# Altium project systems_wiring_diagram.PrjPCB
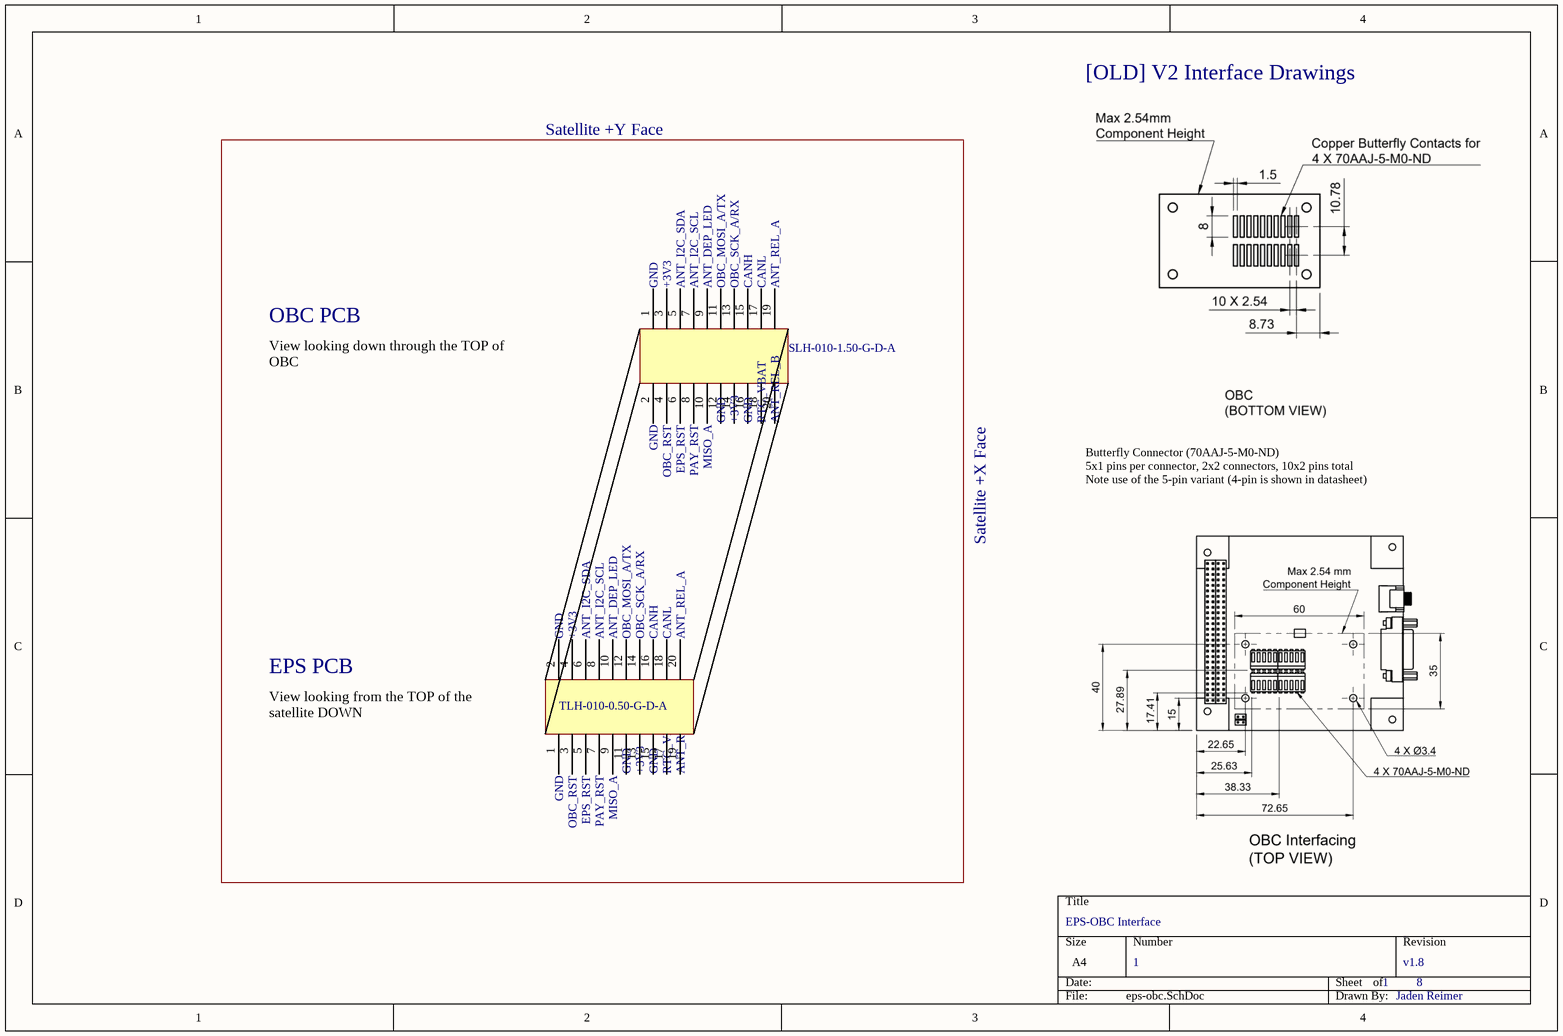
[diagram p0: eps-obc.SchDoc]
ProjectSheetTotal: 8; ProjectRevision: v1.8; ProjectDrawnBy: Jaden Reimer
8 sheets, 83 parts. Net scope: global (net labels, ports and power ports of the same name join across sheets).
Sheets:
  eps-obc.SchDoc
  eps-pay.SchDoc
  eps-sys.SchDoc
  com.SchDoc
  can.SchDoc
  bus.SchDoc
  pay.SchDoc
  sys.SchDoc

## Sheet eps-obc.SchDoc: EPS-OBC Interface
size A4; DocumentNumber: 1; SheetNumber: 1; SheetTotal: 8

### Parts
(Parts that share a designator on the sheet are numbered #1, #2 ... from top to bottom, then left to right.)
J?#1  SLH-010-1.50-G-D-A  [SLH-010-1.50-G-D-A]
J?#2  TLH-010-0.50-G-D-A  [TLH-010-0.50-G-D-A]

### Nets

Not connected (* = marked no-connect by the designer): J?#1 1 2 3 4 5 6 7 8 9 10 11 12 13 14 15 16 17 18 19 20; J?#2 1 2 3 4 5 6 7 8 9 10 11 12 13 14 15 16 17 18 19 20

### Notes on the sheet
- [OLD] V2 Interface Drawings
- Satellite +Y Face
- (near J?#1) GND
- (near J?#1) +3V3
- (near J?#1) ANT_I2C_SDA
- (near J?#1) ANT_I2C_SCL
- (near J?#1) ANT_DEP_LED
- (near J?#1) OBC_MOSI_A/TX
- (near J?#1) OBC_SCK_A/RX
- (near J?#1) CANH
- (near J?#1) CANL
- (near J?#1) ANT_REL_A
- View looking down through the TOP of OBC
- OBC PCB
- (near J?#1) OBC_RST
- (near J?#1) EPS_RST
- (near J?#1) PAY_RST
- (near J?#1) MISO_A
- (near J?#1) RTC_VBAT
- (near J?#1) ANT_REL_B
- Butterfly Connector (70AAJ-5-M0-ND)
  5x1 pins per connector, 2x2 connectors, 10x2 pins total
  Note use of the 5-pin variant (4-pin is shown in datasheet)
- Satellite +X Face
- (near J?#2) GND
- (near J?#2) +3V3
- (near J?#2) ANT_I2C_SDA
- (near J?#2) ANT_I2C_SCL
- (near J?#2) ANT_DEP_LED
- (near J?#2) OBC_MOSI_A/TX
- (near J?#2) OBC_SCK_A/RX
- (near J?#2) CANH
- (near J?#2) CANL
- (near J?#2) ANT_REL_A
- EPS PCB
- (near J?#2) View looking from the TOP of the satellite DOWN
- (near J?#2) OBC_RST
- (near J?#2) EPS_RST
- (near J?#2) PAY_RST
- (near J?#2) MISO_A
- (near J?#2) RTC_VBAT
- (near J?#2) ANT_REL_B

### Library data of the parts
J?#1 = SLH-010-1.50-G-D-A: 0.50 mm Razor Beam™ LP Ultra Low Profile Socket Strip, alignment pin option; Supplier 1: SLH-010-1.50-G-D-A; Supplier Part Number 1: Samtec; ComponentLink1Description: Product Page; ComponentLink1URL: https://www.samtec.com/products/slh-010-1.50-g-d-a
J?#2 = TLH-010-0.50-G-D-A: 0.50 mm Razor Beam LP Ultra Low Profile Terminal Strip, alignment pin option; Supplier 1: Samtec; ComponentLink1Description: Product Page; ComponentLink1URL: https://www.samtec.com/products/tlh-010-0.50-g-d-a; Supplier Part Number 1: TLH-010-0.50-G-D-A

## Sheet eps-pay.SchDoc: EPS-PAY Interface
size A4; DocumentNumber: 2; SheetNumber: 2; SheetTotal: 8
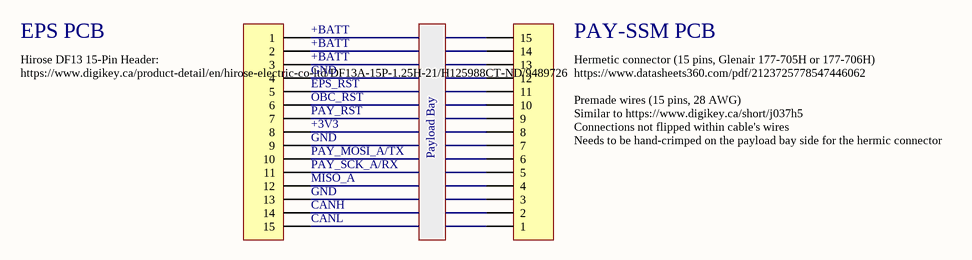
[diagram p1: eps-pay.SchDoc]

### Parts
(Parts that share a designator on the sheet are numbered #1, #2 ... from top to bottom, then left to right.)
P?#1  Header 15  [HDR1X15]  (value not drawn)
P?#2  Header 15  [HDR1X15]  (value not drawn)

### Nets

Not connected (* = marked no-connect by the designer): P?#1 1 2 3 4 5 6 7 8 9 10 11 12 13 14 15; P?#2 1 2 3 4 5 6 7 8 9 10 11 12 13 14 15

### Notes on the sheet
- EPS PCB
- (near P?#1) +BATT
- (near P?#1) GND
- PAY-SSM PCB
- Hermetic connector (15 pins, Glenair 177-705H or 177-706H)
  https://www.datasheets360.com/pdf/2123725778547446062
- Hirose DF13 15-Pin Header:
  https://www.digikey.ca/product-detail/en/hirose-electric-co-ltd/DF13A-15P-1.25H-21/H125988CT-ND/9489726
- (near P?#1) +3V3
- (near P?#1) OBC_RST
- (near P?#1) EPS_RST
- (near P?#1) PAY_RST
- Premade wires (15 pins, 28 AWG)
  Similar to https://www.digikey.ca/short/j037h5
  Connections not flipped within cable's wires
  Needs to be hand-crimped on the payload bay side for the hermic connector
- (near P?#1) CANH
- (near P?#1) PAY_MOSI_A/TX
- (near P?#1) MISO_A
- (near P?#1) PAY_SCK_A/RX
- Payload Bay
- (near P?#1) CANL

### Library data of the parts
P?#1 P?#2 = Header 15: Header, 15-Pin; LatestRevisionDate: 17-Jul-2002; LatestRevisionNote: Re-released for DXP Platform.; Publisher: Altium Limited

## Sheet eps-sys.SchDoc: EPS-SYS Interface
size A4; DocumentNumber: 3; SheetNumber: 3; SheetTotal: 8
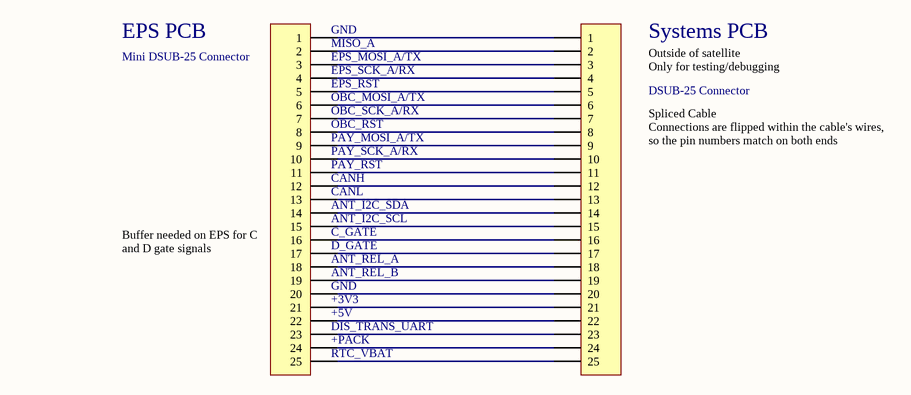
[diagram p2: eps-sys.SchDoc]

### Parts
(Parts that share a designator on the sheet are numbered #1, #2 ... from top to bottom, then left to right.)
P?#3  Header 25  [HDR1X25]  (value not drawn)
P?#4  Header 25  [HDR1X25]  (value not drawn)

### Nets
NetP?#3_1: P?#3.1 P?#4.1
NetP?#3_2: P?#3.2 P?#4.2
NetP?#3_3: P?#3.3 P?#4.3
NetP?#3_4: P?#3.4 P?#4.4
NetP?#3_5: P?#3.5 P?#4.5
NetP?#3_6: P?#3.6 P?#4.6
NetP?#3_7: P?#3.7 P?#4.7
NetP?#3_8: P?#3.8 P?#4.8
NetP?#3_9: P?#3.9 P?#4.9
NetP?#3_10: P?#3.10 P?#4.10
NetP?#3_11: P?#3.11 P?#4.11
NetP?#3_12: P?#3.12 P?#4.12
NetP?#3_13: P?#3.13 P?#4.13
NetP?#3_14: P?#3.14 P?#4.14
NetP?#3_15: P?#3.15 P?#4.15
NetP?#3_16: P?#3.16 P?#4.16
NetP?#3_17: P?#3.17 P?#4.17
NetP?#3_18: P?#3.18 P?#4.18
NetP?#3_19: P?#3.19 P?#4.19
NetP?#3_20: P?#3.20 P?#4.20
NetP?#3_21: P?#3.21 P?#4.21
NetP?#3_22: P?#3.22 P?#4.22
NetP?#3_23: P?#3.23 P?#4.23
NetP?#3_24: P?#3.24 P?#4.24
NetP?#3_25: P?#3.25 P?#4.25

### Notes on the sheet
- EPS PCB
- Mini DSUB-25 Connector
- (near P?#3) GND
- (near P?#3) MISO_A
- (near P?#3) EPS_MOSI_A/TX
- (near P?#3) EPS_SCK_A/RX
- Systems PCB
- Outside of satellite
  Only for testing/debugging
- (near P?#3) EPS_RST
- (near P?#3) OBC_MOSI_A/TX
- (near P?#3) OBC_SCK_A/RX
- (near P?#3) OBC_RST
- DSUB-25 Connector
- (near P?#3) PAY_MOSI_A/TX
- (near P?#3) PAY_SCK_A/RX
- (near P?#3) PAY_RST
- (near P?#3) CANH
- (near P?#3) CANL
- (near P?#3) ANT_I2C_SDA
- Spliced Cable
  Connections are flipped within the cable's wires,
  so the pin numbers match on both ends
- (near P?#3) Buffer needed on EPS for C and D gate signals
- (near P?#3) ANT_REL_A
- (near P?#3) D_GATE
- (near P?#3) C_GATE
- (near P?#3) ANT_I2C_SCL
- (near P?#3) +5V
- (near P?#3) ANT_REL_B
- (near P?#3) +3V3
- (near P?#3) +PACK
- (near P?#3) DIS_TRANS_UART
- (near P?#3) RTC_VBAT

### Library data of the parts
P?#3 P?#4 = Header 25: Header, 25-Pin; LatestRevisionDate: 17-Jul-2002; LatestRevisionNote: Re-released for DXP Platform.; Publisher: Altium Limited

## Sheet com.SchDoc: Communications
size A4; DocumentNumber: 4; SheetNumber: 4; SheetTotal: 8
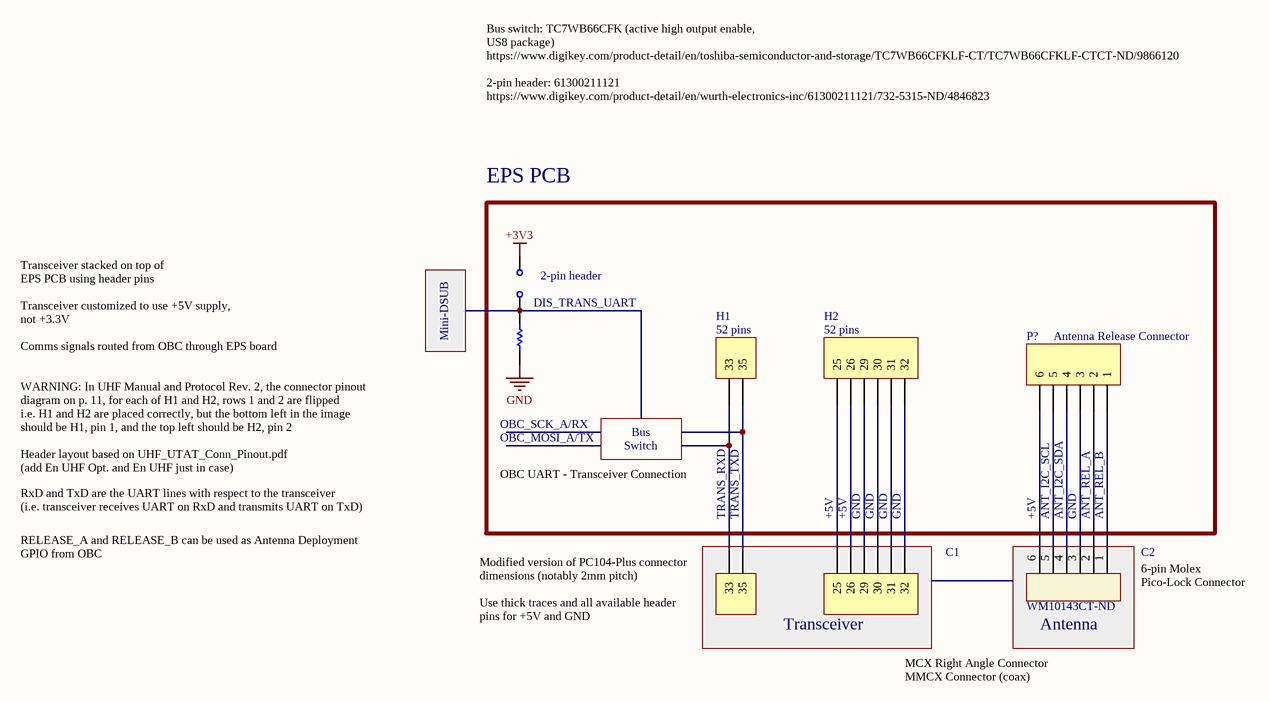
[diagram p3: com.SchDoc]

### Parts
(Parts that share a designator on the sheet are numbered #1, #2 ... from top to bottom, then left to right.)
J?#3  Supplier Part Number 1: WM10143CT-ND  [MOLEX_504050-0691]  (hidden comment: 504050-0691)
P?#5  Header 2  [HDR1X2]  (value not drawn)
P?#6  Header 6  [HDR1X6]  (value not drawn)
P?#7  Header 6  [HDR1X6]  (value not drawn)
P?#8  Header 2  [HDR1X2]  (value not drawn)
P?#9  Header 6  [HDR1X6]  (value not drawn)
R?#1  0402  [RES0402R]  (value not drawn)

### Blocks framed on the sheet
EPS PCB: P?#5-P?#7 R?#1
Transceiver: P?#8 P?#9
Antenna: J?#3

### Nets
GND: R?#1.1
NetJ?#3_1: J?#3.1 P?#7.1
NetJ?#3_2: J?#3.2 P?#7.2
NetJ?#3_3: J?#3.3 P?#7.3
NetJ?#3_4: J?#3.4 P?#7.4
NetJ?#3_5: J?#3.5 P?#7.5
NetJ?#3_6: J?#3.6 P?#7.6
NetP?#5_1: P?#5.1(33) P?#8.1(33)
NetP?#5_2: P?#5.2(35) P?#8.2(35)
NetP?#6_1: P?#6.1(25) P?#9.1(25)
NetP?#6_2: P?#6.2(26) P?#9.2(26)
NetP?#6_3: P?#6.3(29) P?#9.3(29)
NetP?#6_4: P?#6.4(30) P?#9.4(30)
NetP?#6_5: P?#6.5(31) P?#9.5(31)
NetP?#6_6: P?#6.6(32) P?#9.6(32)

Not connected (* = marked no-connect by the designer): R?#1 2

### Notes on the sheet
- Bus switch: TC7WB66CFK (active high output enable, US8 package)
  https://www.digikey.com/product-detail/en/toshiba-semiconductor-and-storage/TC7WB66CFKLF-CT/TC7WB66CFKLF-CTCT-ND/9866120
  2-pin header: 61300211121
  https://www.digikey.com/product-detail/en/wurth-electronics-inc/61300211121/732-5315-ND/4846823
- Transceiver stacked on top of EPS PCB using header pins
- (near R?#1) 2-pin header
- Comms signals routed from OBC through EPS board
- Transceiver customized to use +5V supply, not +3.3V
  To get 2W of power
  (add En UHF Opt. and En UHF just in case)
- Mini-DSUB
- (near R?#1) DIS_TRANS_UART
- (near P?#5) 52 pins
- H1
- (near P?#6) 52 pins
- H2
- (near P?#7) Antenna Release Connector
- WARNING: In UHF Manual and Protocol Rev. 2, the connector pinout diagram on p. 11, for each of H1 and H2, rows 1 and 2 are flipped
  i.e. H1 and H2 are placed correctly, but the bottom left in the image should be H1, pin 1, and the top left should be H2, pin 2
- OBC_SCK_A/RX
- Bus
- Header layout based on UHF_UTAT_Conn_Pinout.pdf
  (add En UHF Opt. and En UHF just in case)
- OBC UART - Transceiver Connection
- OBC_MOSI_A/TX
- Switch
- RxD and TxD are the UART lines with respect to the transceiver
  (i.e. transceiver receives UART on RxD and transmits UART on TxD)
- RELEASE_A and RELEASE_B can be used as Antenna Deployment GPIO from OBC
- TRANS_RXD
- TRANS_TXD
- +5V
- GND
- (near P?#9) C1
- ANT_I2C_SCL
- ANT_I2C_SDA
- ANT_REL_A
- ANT_REL_B
- (near J?#3) C2
- (near P?#8) Modified version of PC104-Plus connector dimensions (notably 2mm pitch)
- (near P?#8) Use thick traces and all available header pins for +5V and GND
- (near J?#3) 6-pin Molex Pico-Lock Connector
- MCX Right Angle Connector
  MMCX Connector (coax)
- Labels drawn without touching a wire or pin: +3V3

### Library data of the parts
J?#3 = 504050-0691: Wire-To-Board Connector, Pico-Lock 504050 Series, Surface Mount, Header, 6, 1.5 mm; Supplier 1: Digi-Key
P?#5 P?#8 = Header 2: Header, 2-Pin; LatestRevisionDate: 17-Jul-2002; LatestRevisionNote: Re-released for DXP Platform.; Publisher: Altium Limited
P?#6 P?#7 P?#9 = Header 6: Header, 6-Pin; LatestRevisionDate: 17-Jul-2002; LatestRevisionNote: Re-released for DXP Platform.; Publisher: Altium Limited
R?#1 = RES0402: 0402 resistor; Value: Value

## Sheet can.SchDoc: CAN Bus
size A4; DocumentNumber: 5; SheetNumber: 5; SheetTotal: 8
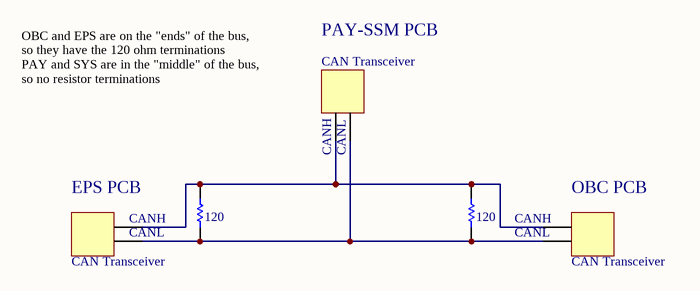
[diagram p4: can.SchDoc]

### Parts
(Parts that share a designator on the sheet are numbered #1, #2 ... from top to bottom, then left to right.)
P?#10  CAN Transceiver  [HDR1X2]
P?#11  CAN Transceiver  [HDR1X2]
P?#12  CAN Transceiver  [HDR1X2]
R?#2  value 120  [AXIAL-0.3]  (hidden comment: Res1)
R?#3  value 120  [AXIAL-0.3]  (hidden comment: Res1)

### Nets
NetP?#10_1: P?#10.1 P?#11.1 P?#12.2 R?#2.1 R?#3.2
NetP?#10_2: P?#10.2 P?#11.2 P?#12.1 R?#2.2 R?#3.1

### Notes on the sheet
- PAY-SSM PCB
- OBC and EPS are on the "ends" of the bus, so they have the 120 ohm terminations
  PAY and SYS are in the "middle" of the bus, so no resistor terminations
- (near P?#12) EPS PCB
- (near P?#10) CANH
- (near P?#10) CANL
- (near P?#11) OBC PCB
- (near P?#12) CANH
- (near P?#12) CANL
- CANH
- CANL

### Library data of the parts
P?#10-P?#12 = Header 2: Header, 2-Pin; LatestRevisionDate: 17-Jul-2002; LatestRevisionNote: Re-released for DXP Platform.; Publisher: Altium Limited
R?#2 R?#3 = Res1: Resistor; Published: 8-Jun-2000; LatestRevisionDate: 17-Jul-2002; LatestRevisionNote: Re-released for DXP Platform.; PackageReference: AXIAL-0.3; Publisher: Altium Limited; PackageDescription: Axial Device, Thru-Hole; 2 Leads; 0.3 in Pin Spacing

## Sheet bus.SchDoc: BUS (EPS and OBC)
size A4; DocumentNumber: 6; SheetNumber: 6; SheetTotal: 8
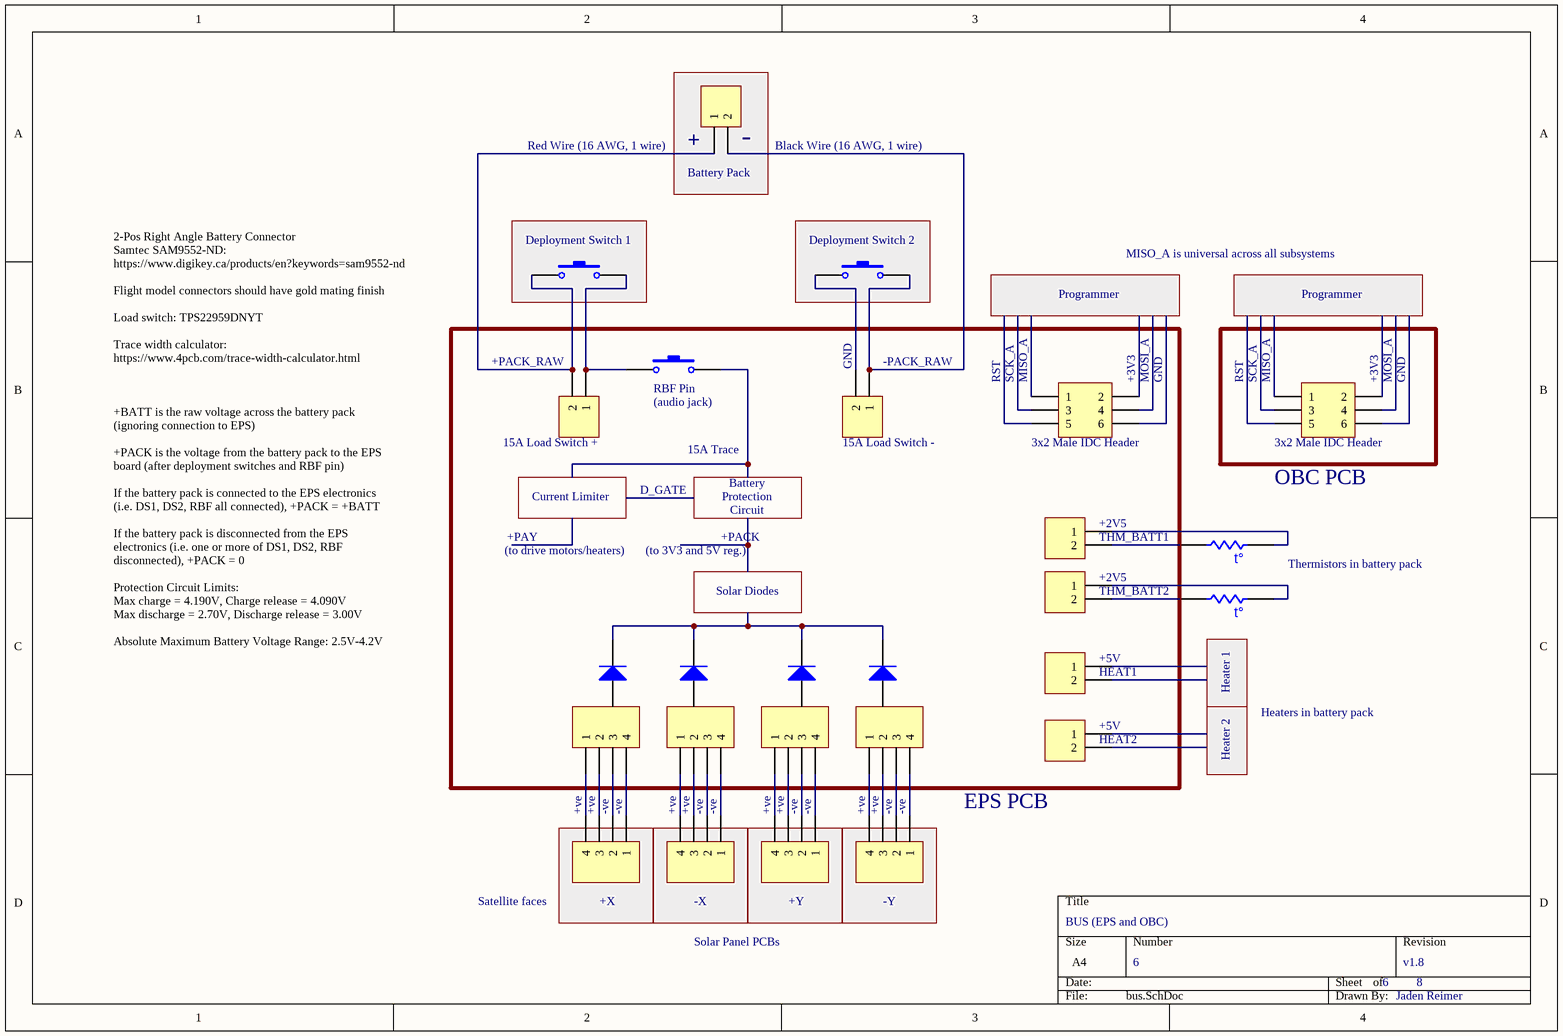
[diagram p5: bus.SchDoc]

### Parts
(Parts that share a designator on the sheet are numbered #1, #2 ... from top to bottom, then left to right.)
D?#1  Diode  [SMC]  (value not drawn)
D?#2  Diode  [SMC]  (value not drawn)
D?#3  Diode  [SMC]  (value not drawn)
D?#4  Diode  [SMC]  (value not drawn)
P?#13  Header 2  [HDR1X2]  (value not drawn)
P?#14  Header 3X2  [HDR2X3]  (value not drawn)
P?#15  Header 3X2  [HDR2X3]  (value not drawn)
P?#16  Header 2  [HDR1X2]  (value not drawn)
P?#17  Header 2  [HDR1X2]  (value not drawn)
P?#18  Header 2  [HDR1X2]  (value not drawn)
P?#19  Header 2  [HDR1X2]  (value not drawn)
P?#20  Header 2  [HDR1X2]  (value not drawn)
P?#21  Header 2  [HDR1X2]  (value not drawn)
P?#22  Header 4  [HDR1X4]  (value not drawn)
P?#23  Header 4  [HDR1X4]  (value not drawn)
P?#24  Header 4  [HDR1X4]  (value not drawn)
P?#25  Header 4  [HDR1X4]  (value not drawn)
P?#26  Header 4  [HDR1X4]  (value not drawn)
P?#27  Header 4  [HDR1X4]  (value not drawn)
P?#28  Header 4  [HDR1X4]  (value not drawn)
P?#29  Header 4  [HDR1X4]  (value not drawn)
RT?#1  Res Thermal  [6-0805_N]  (value not drawn)
RT?#2  Res Thermal  [6-0805_N]  (value not drawn)
S?#1  SW-PB  [SPST-2]  (value not drawn)
S?#2  SW-PB  [SPST-2]  (value not drawn)
S?#3  SW-PB  [SPST-2]  (value not drawn)

### Blocks framed on the sheet
-: P?#13
Deployment Switch 1: S?#1
Deployment Switch 2: S?#2

### Nets
NetD?#1_2: D?#1.2(K) D?#2.2(K) D?#3.2(K) D?#4.2(K)
NetP?#13_1: P?#13.1 P?#16.2 S?#1.1
NetP?#13_2: P?#13.2 P?#17.1 S?#2.2
NetP?#16_1: P?#16.1 S?#1.2 S?#3.1
NetP?#17_2: P?#17.2 S?#2.1
NetP?#18_1: P?#18.1 RT?#1.1
NetP?#18_2: P?#18.2 RT?#1.2
NetP?#19_1: P?#19.1 RT?#2.1
NetP?#19_2: P?#19.2 RT?#2.2
NetP?#22_1: P?#22.1 P?#26.4
NetP?#22_2: P?#22.2 P?#26.3
NetP?#22_3: P?#22.3 P?#26.2
NetP?#22_4: P?#22.4 P?#26.1
NetP?#23_1: P?#23.1 P?#27.4
NetP?#23_2: P?#23.2 P?#27.3
NetP?#23_3: P?#23.3 P?#27.2
NetP?#23_4: P?#23.4 P?#27.1
NetP?#24_1: P?#24.1 P?#28.4
NetP?#24_2: P?#24.2 P?#28.3
NetP?#24_3: P?#24.3 P?#28.2
NetP?#24_4: P?#24.4 P?#28.1
NetP?#25_1: P?#25.1 P?#29.4
NetP?#25_2: P?#25.2 P?#29.3
NetP?#25_3: P?#25.3 P?#29.2
NetP?#25_4: P?#25.4 P?#29.1

Not connected (* = marked no-connect by the designer): D?#1 1(A); D?#2 1(A); D?#3 1(A); D?#4 1(A); P?#14 1 2 3 4 5 6; P?#15 1 2 3 4 5 6; P?#20 1 2; P?#21 1 2; S?#3 2

### Notes on the sheet
- (near P?#13) Red Wire (16 AWG, 1 wire)
- (near P?#13) Battery Pack
- (near P?#13) +
- (near P?#13) Black Wire (16 AWG, 1 wire)
- Programmer
- MISO_A is universal across all subsystems
- 2-Pos Right Angle Battery Connector
  Samtec SAM9552-ND:
  https://www.digikey.ca/products/en?keywords=sam9552-nd
  Flight model connectors should have gold mating finish
  Load switch: TPS22959DNYT
  Trace width calculator: https://www.4pcb.com/trace-width-calculator.html
- (near P?#16) +PACK_RAW
- (near P?#17) GND
- (near P?#17) -PACK_RAW
- RST
- (near P?#14) SCK_A
- (near P?#14) MISO_A
- (near P?#14) +3V3
- (near P?#14) MOSI_A
- (near P?#14) GND
- (near P?#15) SCK_A
- (near P?#15) MISO_A
- (near P?#15) +3V3
- (near P?#15) MOSI_A
- (near P?#15) GND
- (near P?#16) 15A Load Switch +
- (near S?#3) (audio jack)
- (near S?#3) RBF Pin
- (near P?#17) 15A Load Switch -
- (near P?#14) 3x2 Male IDC Header
- (near P?#15) 3x2 Male IDC Header
- Current Limiter
- D_GATE
- 15A Trace
- Battery
- Protection
- Circuit
- OBC PCB
- +PAY
- (to drive motors/heaters)
- +PACK
- (to 3V3 and 5V reg.)
- (near P?#18) +2V5
- (near P?#18) THM_BATT1
- (near P?#19) +2V5
- (near RT?#1) Thermistors in battery pack
- +BATT is the raw voltage across the battery pack (ignoring connection to EPS)
  +PACK is the voltage from the battery pack to the EPS board (after deployment switches and RBF pin)
  If the battery pack is connected to the EPS electronics (i.e. DS1, DS2, RBF all connected), +PACK = +BATT
  If the battery pack is disconnected from the EPS electronics (i.e. one or more of DS1, DS2, RBF disconnected), +PACK = 0
  Protection Circuit Limits:
  Max charge = 4.190V, Charge release = 4.090V
  Max discharge = 2.70V, Discharge release = 3.00V
  Absolute Maximum Battery Voltage Range: 2.5V-4.2V
- Solar Diodes
- (near P?#19) THM_BATT2
- (near P?#20) HEAT1
- (near P?#20) +5V
- (near RT?#2) Heater 1
- Heaters in battery pack
- (near P?#21) HEAT2
- (near P?#21) +5V
- Heater 2
- (near P?#26) +ve
- (near P?#26) -ve
- (near P?#27) +ve
- (near P?#27) -ve
- (near P?#28) +ve
- (near P?#28) -ve
- (near P?#29) +ve
- (near P?#29) -ve
- EPS PCB
- Satellite faces
- +X
- -X
- +Y
- -Y
- Solar Panel PCBs
- (in symbol Res Thermal) t°

### Library data of the parts
D?#1-D?#4 = Diode: Default Diode; Published: 8-Jun-2000; LatestRevisionDate: 17-Jul-2002; LatestRevisionNote: Re-released for DXP Platform.; PackageVersion: Sep-1996; PackageReference: SMC; Publisher: Altium Limited; PackageDescription: DO-214-AB/SMC; 2 C-Bend Leads; Body 7.9 x 5.9 mm, inc. leads (LxW); Code_JEDEC: DO-214-AB
P?#13 P?#16-P?#21 = Header 2: Header, 2-Pin; LatestRevisionDate: 17-Jul-2002; LatestRevisionNote: Re-released for DXP Platform.; Publisher: Altium Limited
P?#14 P?#15 = Header 3X2: Header, 3-Pin, Dual row; LatestRevisionDate: 17-Jul-2002; LatestRevisionNote: Re-released for DXP Platform.; Publisher: Altium Limited
P?#22-P?#29 = Header 4: Header, 4-Pin; LatestRevisionDate: 17-Jul-2002; LatestRevisionNote: Re-released for DXP Platform.; Publisher: Altium Limited
RT?#1 RT?#2 = Res Thermal: Thermistor; Published: 24-Mar-1999; LatestRevisionDate: 29-May-2009; LatestRevisionNote: IPC-7351 Footprint Added.; PackageVersion: Mar-2003; PackageReference: 6-0805; Publisher: Altium Limited; PackageDescription: Chip Resistor 0805 Case Size; Code_IPC: RESC2012
S?#1-S?#3 = SW-PB: Switch; Published: 24-Mar-1999; LatestRevisionDate: 17-Jul-2002; LatestRevisionNote: Re-released for DXP Platform.; PackageReference: SPST-2; Publisher: Altium Limited; PackageDescription: Switch; 2 Leads

## Sheet pay.SchDoc: Payload
size A4; DocumentNumber: 7; SheetNumber: 7; SheetTotal: 8
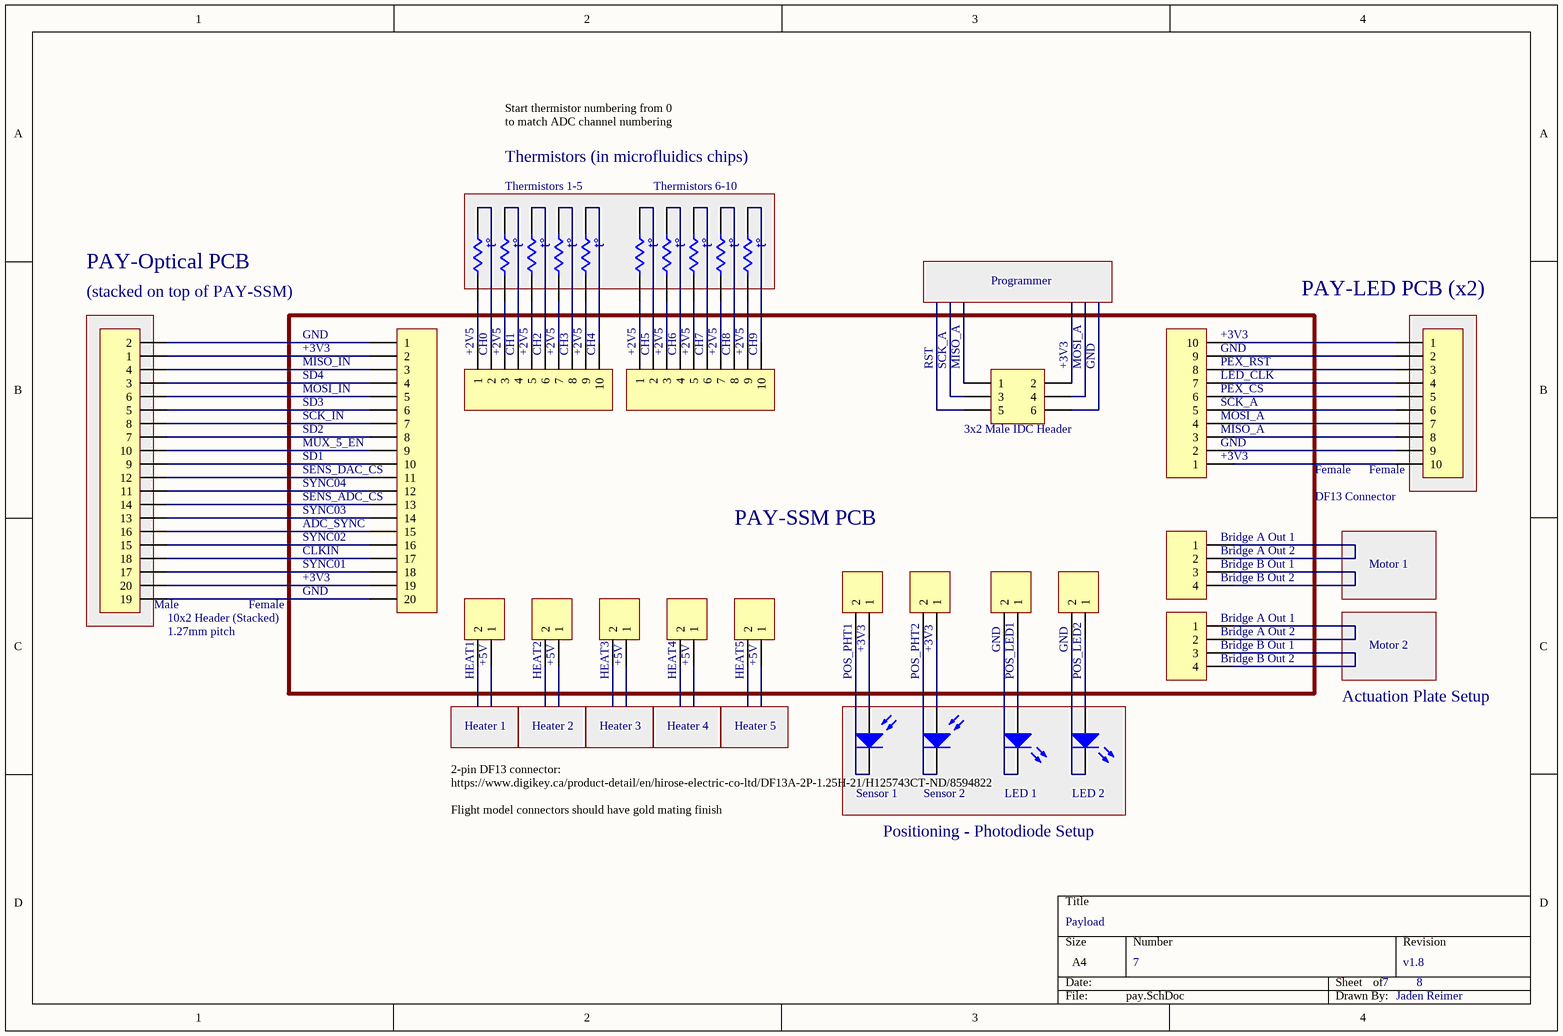
[diagram p6: pay.SchDoc]

### Parts
(Parts that share a designator on the sheet are numbered #1, #2 ... from top to bottom, then left to right.)
D?#5  Photo Sen  [PIN2]  (value not drawn)
D?#6  Photo Sen  [PIN2]  (value not drawn)
D?#7  LED0  [LED-0]  (value not drawn)
D?#8  LED0  [LED-0]  (value not drawn)
P?#30  Header 20  [HDR1X20]  (value not drawn)
P?#31  Header 20  [HDR1X20]  (value not drawn)
P?#32  Header 10  [HDR1X10]  (value not drawn)
P?#33  Header 10  [HDR1X10]  (value not drawn)
P?#34  Header 10  [HDR1X10]  (value not drawn)
P?#35  Header 3X2  [HDR2X3]  (value not drawn)
P?#36  Header 10  [HDR1X10]  (value not drawn)
P?#37  Header 4  [HDR1X4]  (value not drawn)
P?#38  Header 2  [HDR1X2]  (value not drawn)
P?#39  Header 2  [HDR1X2]  (value not drawn)
P?#40  Header 2  [HDR1X2]  (value not drawn)
P?#41  Header 2  [HDR1X2]  (value not drawn)
P?#42  Header 4  [HDR1X4]  (value not drawn)
P?#43  Header 2  [HDR1X2]  (value not drawn)
P?#44  Header 2  [HDR1X2]  (value not drawn)
P?#45  Header 2  [HDR1X2]  (value not drawn)
P?#46  Header 2  [HDR1X2]  (value not drawn)
P?#47  Header 2  [HDR1X2]  (value not drawn)
RT?#3  Res Thermal  [6-0805_N]  (value not drawn)
RT?#4  Res Thermal  [6-0805_N]  (value not drawn)
RT?#5  Res Thermal  [6-0805_N]  (value not drawn)
RT?#6  Res Thermal  [6-0805_N]  (value not drawn)
RT?#7  Res Thermal  [6-0805_N]  (value not drawn)
RT?#8  Res Thermal  [6-0805_N]  (value not drawn)
RT?#9  Res Thermal  [6-0805_N]  (value not drawn)
RT?#10  Res Thermal  [6-0805_N]  (value not drawn)
RT?#11  Res Thermal  [6-0805_N]  (value not drawn)
RT?#12  Res Thermal  [6-0805_N]  (value not drawn)

### Blocks framed on the sheet
(stacked on top of PAY-SSM): P?#30

### Nets
NetD?#5_1: D?#5.1(A) P?#38.1
NetD?#5_2: D?#5.2(K) P?#38.2
NetD?#6_1: D?#6.1(A) P?#39.1
NetD?#6_2: D?#6.2(K) P?#39.2
NetD?#7_1: D?#7.1(A) P?#40.1
NetD?#7_2: D?#7.2(K) P?#40.2
NetD?#8_1: D?#8.1(A) P?#41.1
NetD?#8_2: D?#8.2(K) P?#41.2
NetP?#30_1: P?#30.1(2) P?#31.1
NetP?#30_2: P?#30.2(1) P?#31.2
NetP?#30_3: P?#30.3(4) P?#31.3
NetP?#30_4: P?#30.4(3) P?#31.4
NetP?#30_5: P?#30.5(6) P?#31.5
NetP?#30_6: P?#30.6(5) P?#31.6
NetP?#30_7: P?#30.7(8) P?#31.7
NetP?#30_8: P?#30.8(7) P?#31.8
NetP?#30_9: P?#30.9(10) P?#31.9
NetP?#30_10: P?#30.10(9) P?#31.10
NetP?#30_11: P?#30.11(12) P?#31.11
NetP?#30_12: P?#30.12(11) P?#31.12
NetP?#30_13: P?#30.13(14) P?#31.13
NetP?#30_14: P?#30.14(13) P?#31.14
NetP?#30_15: P?#30.15(16) P?#31.15
NetP?#30_16: P?#30.16(15) P?#31.16
NetP?#30_17: P?#30.17(18) P?#31.17
NetP?#30_18: P?#30.18(17) P?#31.18
NetP?#30_19: P?#30.19(20) P?#31.19
NetP?#30_20: P?#30.20(19) P?#31.20
NetP?#32_1: P?#32.1 P?#36.10
NetP?#32_2: P?#32.2 P?#36.9
NetP?#32_3: P?#32.3 P?#36.8
NetP?#32_4: P?#32.4 P?#36.7
NetP?#32_5: P?#32.5 P?#36.6
NetP?#32_6: P?#32.6 P?#36.5
NetP?#32_7: P?#32.7 P?#36.4
NetP?#32_8: P?#32.8 P?#36.3
NetP?#32_9: P?#32.9 P?#36.2
NetP?#32_10: P?#32.10 P?#36.1
NetP?#33_1: P?#33.1 RT?#3.2
NetP?#33_2: P?#33.2 RT?#3.1
NetP?#33_3: P?#33.3 RT?#4.2
NetP?#33_4: P?#33.4 RT?#4.1
NetP?#33_5: P?#33.5 RT?#5.2
NetP?#33_6: P?#33.6 RT?#5.1
NetP?#33_7: P?#33.7 RT?#6.2
NetP?#33_8: P?#33.8 RT?#6.1
NetP?#33_9: P?#33.9 RT?#7.2
NetP?#33_10: P?#33.10 RT?#7.1
NetP?#34_1: P?#34.1 RT?#8.2
NetP?#34_2: P?#34.2 RT?#8.1
NetP?#34_3: P?#34.3 RT?#9.2
NetP?#34_4: P?#34.4 RT?#9.1
NetP?#34_5: P?#34.5 RT?#10.2
NetP?#34_6: P?#34.6 RT?#10.1
NetP?#34_7: P?#34.7 RT?#11.2
NetP?#34_8: P?#34.8 RT?#11.1
NetP?#34_9: P?#34.9 RT?#12.2
NetP?#34_10: P?#34.10 RT?#12.1
NetP?#37_1: P?#37.1 P?#37.2
NetP?#37_3: P?#37.3 P?#37.4
NetP?#42_1: P?#42.1 P?#42.2
NetP?#42_3: P?#42.3 P?#42.4

Not connected (* = marked no-connect by the designer): P?#35 1 2 3 4 5 6; P?#43 1 2; P?#44 1 2; P?#45 1 2; P?#46 1 2; P?#47 1 2

### Notes on the sheet
- Thermistors (in microfluidics chips)
- Start thermistor numbering from 0 to match ADC channel numbering
- (near RT?#4) Thermistors 1-5
- (near RT?#9) Thermistors 6-10
- PAY-Optical PCB
- Programmer
- (near P?#32) PAY-LED PCB (x2)
- +3V3
- GND
- (near P?#31) MISO_IN
- SD4
- (near P?#33) +2V5
- (near P?#33) CH0
- (near P?#33) CH1
- (near P?#33) CH2
- (near P?#33) CH3
- (near P?#33) CH4
- (near P?#34) +2V5
- (near P?#34) CH5
- (near P?#34) CH6
- (near P?#34) CH7
- (near P?#34) CH8
- (near P?#34) CH9
- RST
- (near P?#35) SCK_A
- (near P?#35) MISO_A
- (near P?#35) +3V3
- (near P?#35) MOSI_A
- (near P?#35) GND
- (near P?#36) +3V3
- (near P?#36) GND
- (near P?#36) PEX_RST
- (near P?#36) LED_CLK
- (near P?#31) MOSI_IN
- SD3
- SCK_IN
- SD2
- (near P?#31) MUX_5_EN
- (near P?#35) 3x2 Male IDC Header
- (near P?#36) PEX_CS
- (near P?#36) SCK_A
- (near P?#36) MOSI_A
- (near P?#36) MISO_A
- SD1
- SYNC04
- (near P?#31) SENS_DAC_CS
- (near P?#31) SENS_ADC_CS
- SYNC03
- (near P?#32) DF13 Connector
- Female
- (near P?#32) Female
- (near P?#31) ADC_SYNC
- SYNC02
- CLKIN
- SYNC01
- PAY-SSM PCB
- (near P?#37) Bridge A Out 1
- (near P?#37) Bridge A Out 2
- (near P?#37) Bridge B Out 1
- (near P?#37) Bridge B Out 2
- Motor 1
- (near P?#30) Male
- (near P?#30) 10x2 Header (Stacked)
- (near P?#30) 1.27mm pitch
- (near P?#38) +3V3
- (near P?#39) +3V3
- (near P?#40) GND
- (near P?#41) GND
- (near P?#42) Bridge A Out 1
- (near P?#42) Bridge A Out 2
- (near P?#42) Bridge B Out 1
- Motor 2
- (near P?#43) HEAT1
- (near P?#43) +5V
- (near P?#44) HEAT2
- (near P?#44) +5V
- (near P?#45) HEAT3
- (near P?#45) +5V
- (near P?#46) HEAT4
- (near P?#46) +5V
- (near P?#47) HEAT5
- (near P?#47) +5V
- (near P?#38) POS_PHT1
- (near P?#39) POS_PHT2
- (near P?#40) POS_LED1
- (near P?#41) POS_LED2
- (near P?#42) Bridge B Out 2
- Actuation Plate Setup
- Heater 1
- Heater 2
- Heater 3
- Heater 4
- Heater 5
- 2-pin DF13 connector:
  https://www.digikey.ca/product-detail/en/hirose-electric-co-ltd/DF13A-2P-1.25H-21/H125743CT-ND/8594822
  Flight model connectors should have gold mating finish
- (near D?#5) Sensor 1
- Positioning - Photodiode Setup
- (near D?#6) Sensor 2
- (near D?#7) LED 1
- (near D?#8) LED 2
- (in symbol Res Thermal) t°

### Library data of the parts
D?#5 D?#6 = Photo Sen: Photosensitive Diode; Published: 24-Mar-1999; LatestRevisionDate: 17-Jul-2002; LatestRevisionNote: Re-released for DXP Platform.; PackageReference: PIN2; Publisher: Altium Limited
D?#7 D?#8 = LED0: Typical INFRARED GaAs LED; Published: 8-Jun-2000; LatestRevisionDate: 08-Jul-2005; LatestRevisionNote: Mech Layer 1 removed.; PackageReference: LED-0; Publisher: Altium Limited; PackageDescription: LED; 2 Leads
P?#30 P?#31 = Header 20: Header, 20-Pin; LatestRevisionDate: 17-Jul-2002; LatestRevisionNote: Re-released for DXP Platform.; Publisher: Altium Limited
P?#32-P?#34 P?#36 = Header 10: Header, 10-Pin; LatestRevisionDate: 17-Jul-2002; LatestRevisionNote: Re-released for DXP Platform.; Publisher: Altium Limited
P?#35 = Header 3X2: Header, 3-Pin, Dual row; LatestRevisionDate: 17-Jul-2002; LatestRevisionNote: Re-released for DXP Platform.; Publisher: Altium Limited
P?#37 P?#42 = Header 4: Header, 4-Pin; LatestRevisionDate: 17-Jul-2002; LatestRevisionNote: Re-released for DXP Platform.; Publisher: Altium Limited
P?#38-P?#41 P?#43-P?#47 = Header 2: Header, 2-Pin; LatestRevisionDate: 17-Jul-2002; LatestRevisionNote: Re-released for DXP Platform.; Publisher: Altium Limited
RT?#3-RT?#12 = Res Thermal: Thermistor; Published: 24-Mar-1999; LatestRevisionDate: 29-May-2009; LatestRevisionNote: IPC-7351 Footprint Added.; PackageVersion: Mar-2003; PackageReference: 6-0805; Publisher: Altium Limited; PackageDescription: Chip Resistor 0805 Case Size; Code_IPC: RESC2012

## Sheet sys.SchDoc: Systems (Debugging)
size A4; DocumentNumber: 8; SheetNumber: 8; SheetTotal: 8
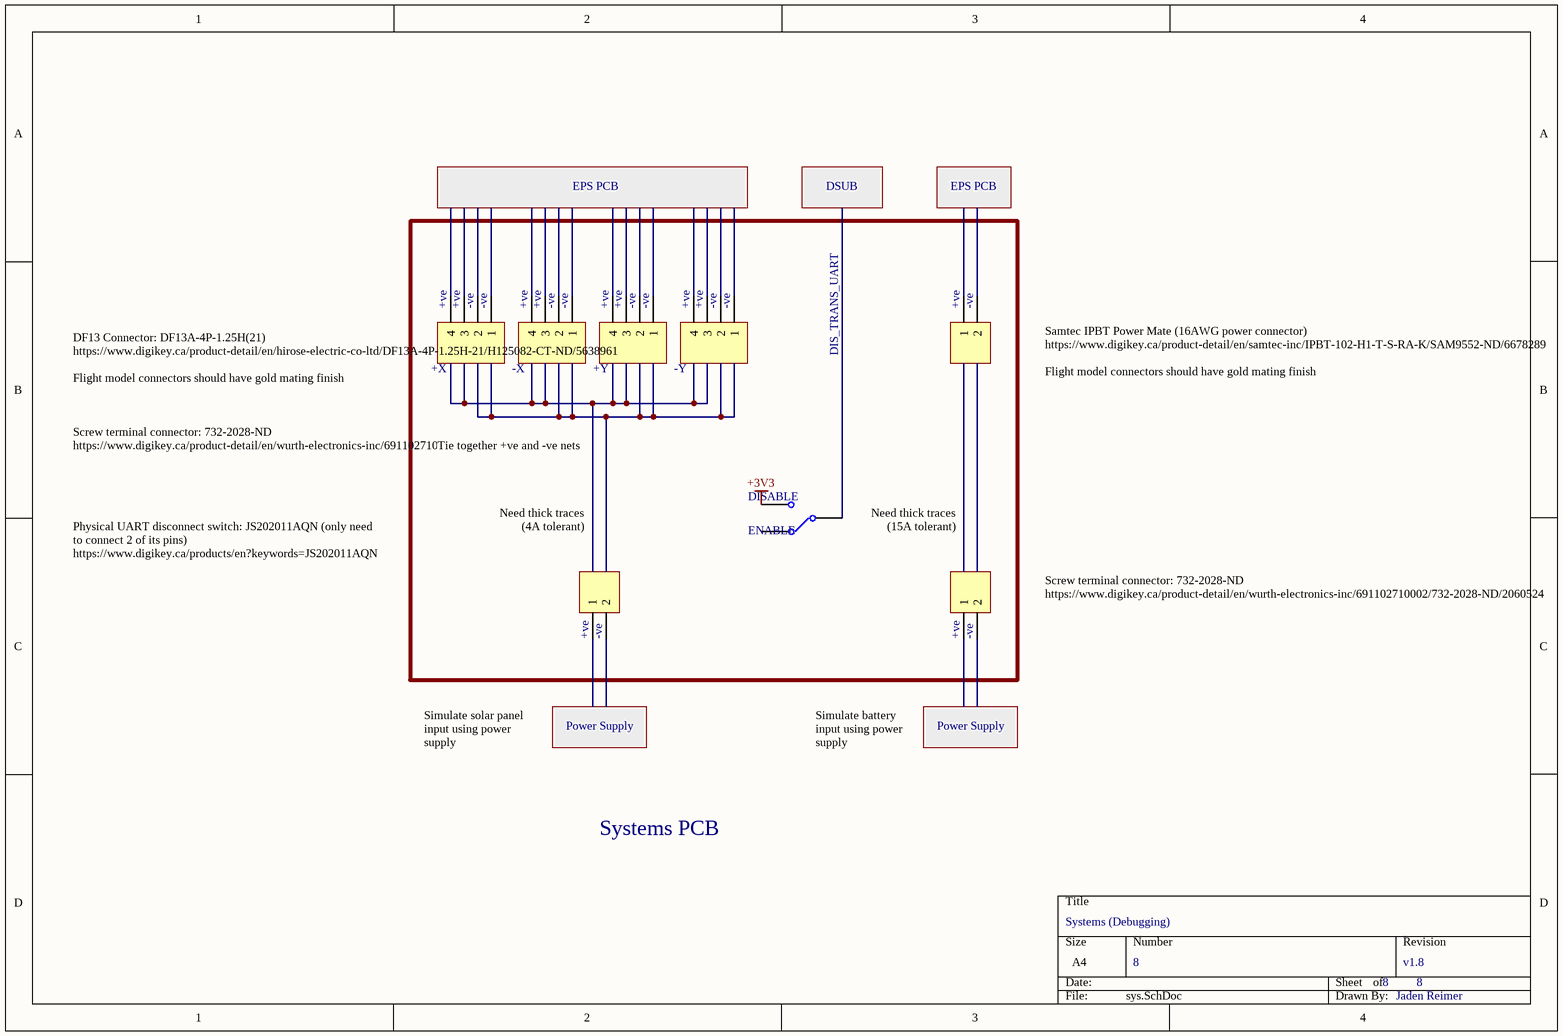
[diagram p7: sys.SchDoc]

### Parts
(Parts that share a designator on the sheet are numbered #1, #2 ... from top to bottom, then left to right.)
P?#48  Header 4  [HDR1X4]  (value not drawn)
P?#49  Header 4  [HDR1X4]  (value not drawn)
P?#50  Header 4  [HDR1X4]  (value not drawn)
P?#51  Header 4  [HDR1X4]  (value not drawn)
P?#52  Header 2  [HDR1X2]  (value not drawn)
P?#53  Header 2  [HDR1X2]  (value not drawn)
P?#54  Header 2  [HDR1X2]  (value not drawn)

### Nets

Not connected (* = marked no-connect by the designer): P?#48 1 2 3 4; P?#49 1 2 3 4; P?#50 1 2 3 4; P?#51 1 2 3 4; P?#52 1 2; P?#53 1 2; P?#54 1 2

### Notes on the sheet
- EPS PCB
- DSUB
- (near P?#48) +ve
- (near P?#48) -ve
- (near P?#49) +ve
- (near P?#49) -ve
- (near P?#50) +ve
- (near P?#50) -ve
- (near P?#51) +ve
- (near P?#51) -ve
- (near P?#52) +ve
- (near P?#52) -ve
- (near P?#48) +X
- (near P?#49) -X
- (near P?#50) +Y
- (near P?#51) -Y
- DIS_TRANS_UART
- DF13 Connector: DF13A-4P-1.25H(21)
  https://www.digikey.ca/product-detail/en/hirose-electric-co-ltd/DF13A-4P-1.25H-21/H125082-CT-ND/5638961
  Flight model connectors should have gold mating finish
- Tie together +ve and -ve nets
- Samtec IPBT Power Mate (16AWG power connector)
  https://www.digikey.ca/product-detail/en/samtec-inc/IPBT-102-H1-T-S-RA-K/SAM9552-ND/6678289
  Flight model connectors should have gold mating finish
- Screw terminal connector: 732-2028-ND
  https://www.digikey.ca/product-detail/en/wurth-electronics-inc/691102710002/732-2028-ND/2060524
- DISABLE
- Physical UART disconnect switch: JS202011AQN (only need to connect 2 of its pins)
  https://www.digikey.ca/products/en?keywords=JS202011AQN
- Need thick traces (4A tolerant)
- ENABLE
- Need thick traces
  (15A tolerant)
- (near P?#53) +ve
- (near P?#53) -ve
- (near P?#54) +ve
- (near P?#54) -ve
- Simulate solar panel input using power supply
- Power Supply
- Simulate battery input using power supply
- Systems PCB
- Labels drawn without touching a wire or pin: +3V3

### Library data of the parts
P?#48-P?#51 = Header 4: Header, 4-Pin; LatestRevisionDate: 17-Jul-2002; LatestRevisionNote: Re-released for DXP Platform.; Publisher: Altium Limited
P?#52-P?#54 = Header 2: Header, 2-Pin; LatestRevisionDate: 17-Jul-2002; LatestRevisionNote: Re-released for DXP Platform.; Publisher: Altium Limited